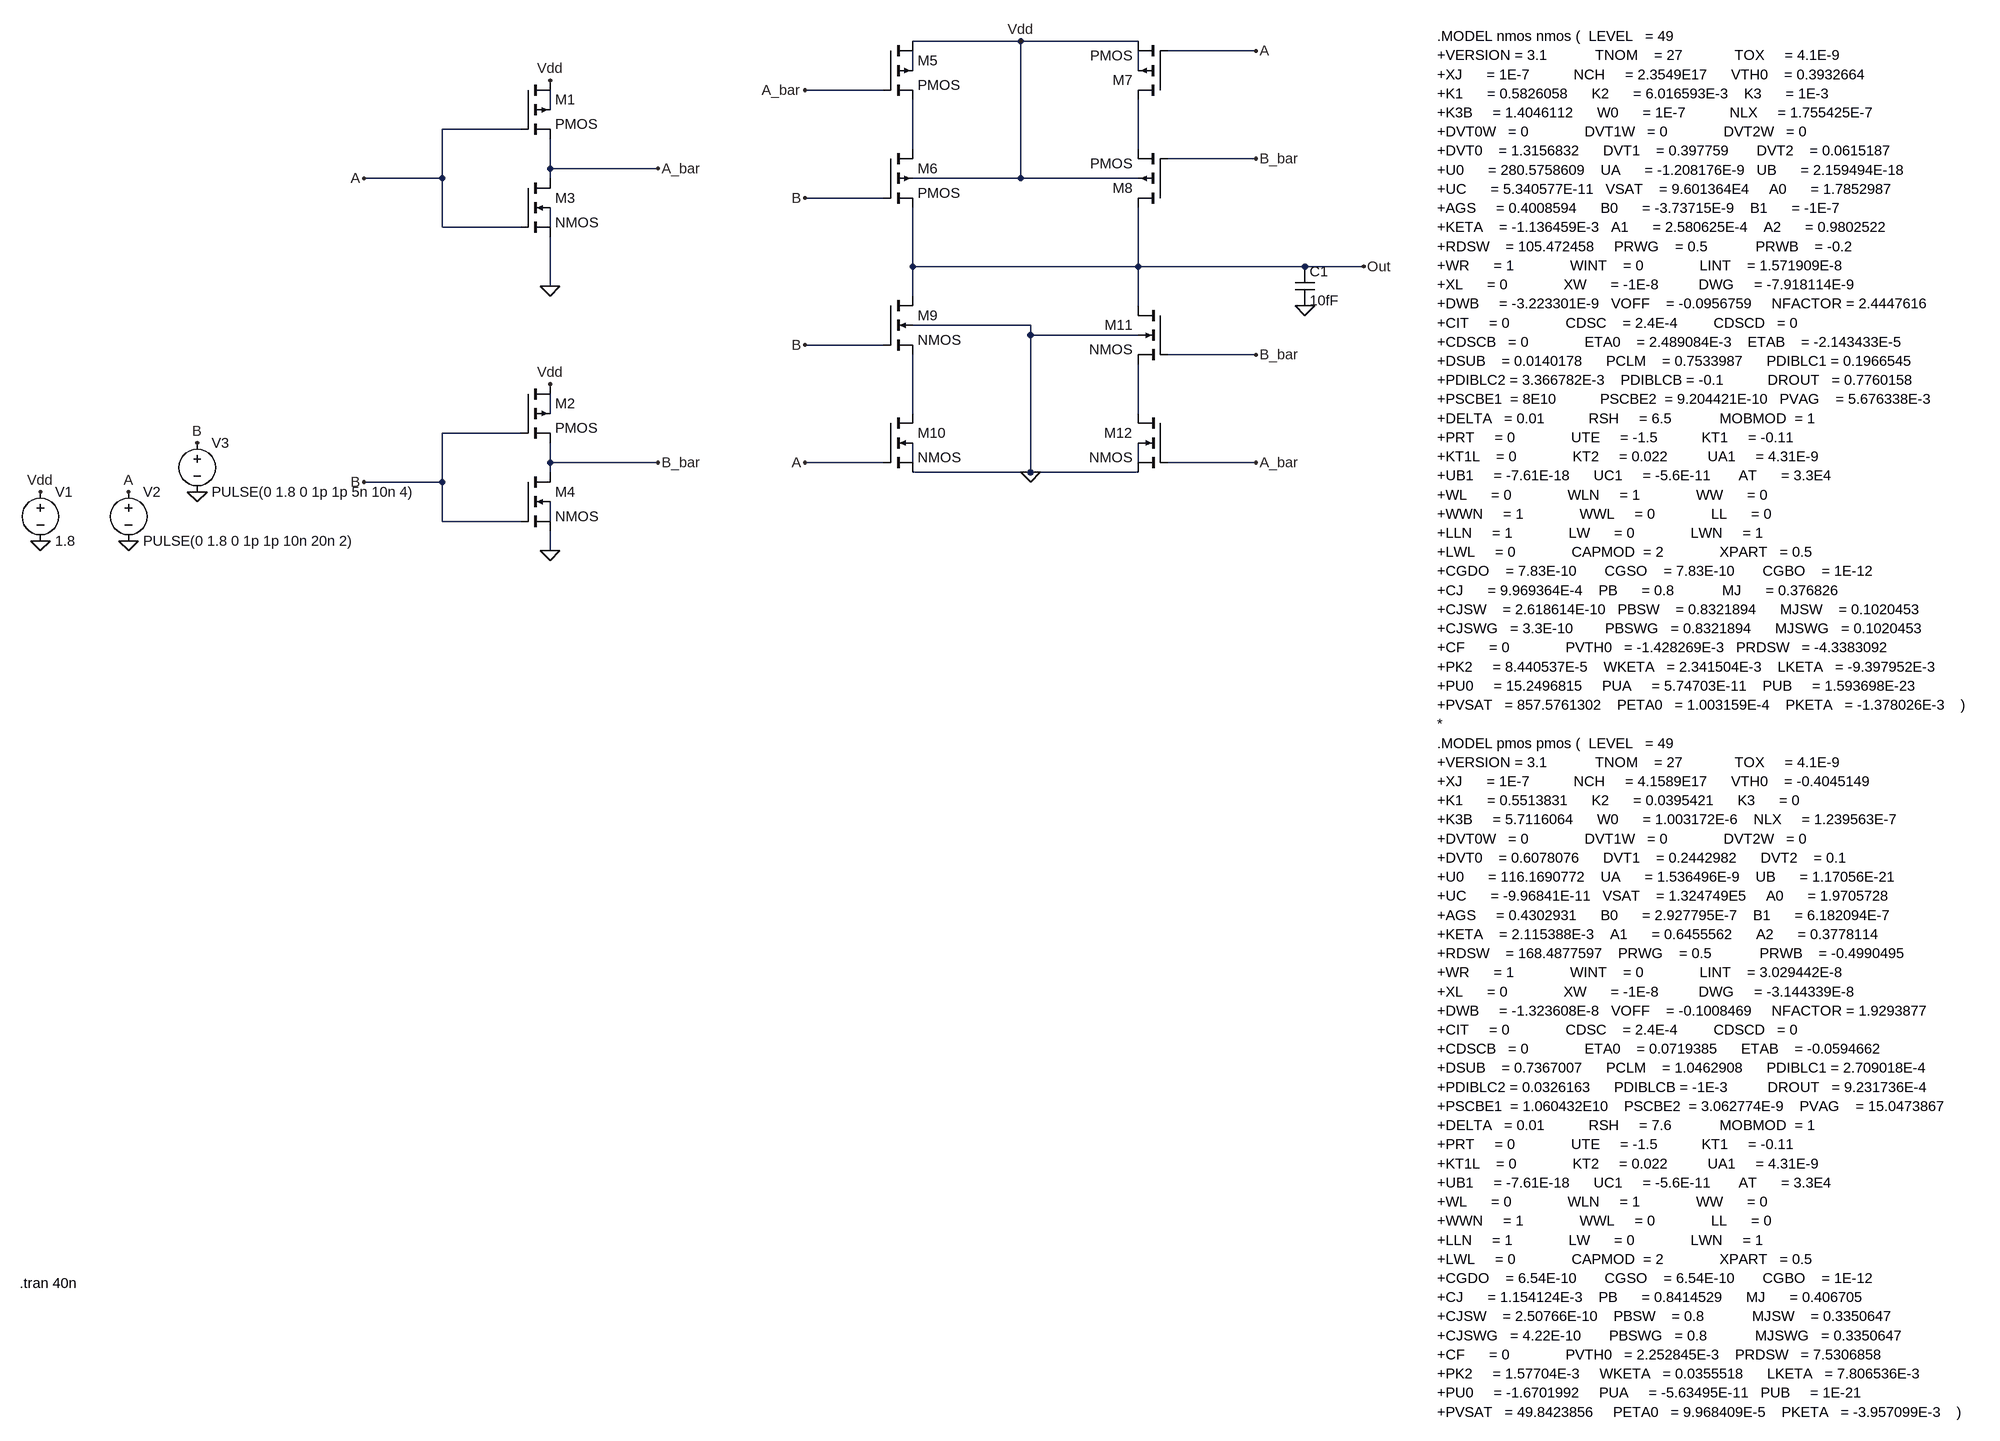
[diagram p0: schematic xor.asc]
xor.asc, the LTspice schematic file:
Version 4
SHEET 1 3156 1516
WIRE 1536 -528 1360 -528
WIRE 1728 -528 1536 -528
WIRE 1920 -512 1776 -512
WIRE 1360 -480 1360 -512
WIRE 1728 -480 1728 -512
WIRE 1312 -448 1184 -448
WIRE 768 -416 768 -448
WIRE 720 -384 592 -384
WIRE 1360 -352 1360 -432
WIRE 1728 -352 1728 -432
WIRE 1920 -336 1776 -336
WIRE 768 -320 768 -368
WIRE 944 -320 768 -320
WIRE 592 -304 592 -384
WIRE 592 -304 464 -304
WIRE 768 -304 768 -320
WIRE 1536 -304 1536 -528
WIRE 1536 -304 1360 -304
WIRE 1728 -304 1536 -304
WIRE 1312 -272 1184 -272
WIRE 592 -224 592 -304
WIRE 720 -224 592 -224
WIRE 768 -224 768 -256
WIRE 1360 -160 1360 -256
WIRE 1728 -160 1728 -256
WIRE 1728 -160 1360 -160
WIRE 2000 -160 1728 -160
WIRE 2096 -160 2000 -160
WIRE 768 -128 768 -208
WIRE 1360 -112 1360 -160
WIRE 1728 -96 1728 -160
WIRE 1552 -64 1360 -64
WIRE 1552 -48 1552 -64
WIRE 1728 -48 1552 -48
WIRE 1312 -32 1184 -32
WIRE 1920 -16 1776 -16
WIRE 768 80 768 48
WIRE 1360 80 1360 -16
WIRE 1728 80 1728 0
WIRE 720 112 592 112
WIRE 768 160 768 128
WIRE 944 160 768 160
WIRE 1312 160 1184 160
WIRE 1360 160 1360 128
WIRE 1728 160 1728 128
WIRE 1920 160 1776 160
WIRE 768 176 768 160
WIRE 1552 176 1552 -48
WIRE 1552 176 1360 176
WIRE 1728 176 1552 176
WIRE 592 192 592 112
WIRE 592 192 464 192
WIRE 592 256 592 192
WIRE 720 256 592 256
WIRE 768 256 768 224
WIRE 768 304 768 272
FLAG -64 288 0
FLAG 80 288 0
FLAG 192 208 0
FLAG 768 304 0
FLAG 768 -128 0
FLAG 2000 -96 0
FLAG 1552 176 0
FLAG 464 -304 A
FLAG 1184 160 A
FLAG 1920 -512 A
FLAG 2096 -160 Out
FLAG 464 192 B
FLAG 1184 -272 B
FLAG 1184 -32 B
FLAG 80 208 A
FLAG -64 208 Vdd
FLAG 1536 -528 Vdd
FLAG 944 -320 A_bar
FLAG 1184 -448 A_bar
FLAG 1920 160 A_bar
FLAG 944 160 B_bar
FLAG 1920 -336 B_bar
FLAG 1920 -16 B_bar
FLAG 768 32 Vdd
FLAG 768 -464 Vdd
FLAG 192 128 B
SYMBOL voltage -64 192 R0
SYMATTR InstName V1
SYMATTR Value 1.8
SYMBOL voltage 80 192 R0
WINDOW 123 0 0 Left 0
WINDOW 39 0 0 Left 0
SYMATTR InstName V2
SYMATTR Value PULSE(0 1.8 0 1p 1p 10n 20n 2)
SYMBOL voltage 192 112 R0
SYMATTR InstName V3
SYMATTR Value PULSE(0 1.8 0 1p 1p 5n 10n 4)
SYMBOL pmos4 720 -464 R0
SYMATTR InstName M1
SYMATTR Value2 l=180n w=360n
SYMBOL pmos4 720 32 R0
SYMATTR InstName M2
SYMATTR Value2 l=180n w=360n
SYMBOL nmos4 720 -304 R0
SYMATTR InstName M3
SYMATTR Value2 l=180n w=360n
SYMBOL nmos4 720 176 R0
SYMATTR InstName M4
SYMATTR Value2 l=180n w=360n
SYMBOL pmos4 1312 -528 R0
SYMATTR InstName M5
SYMATTR Value2 l=180n w=360n
SYMBOL pmos4 1312 -352 R0
SYMATTR InstName M6
SYMATTR Value2 l=180n w=360n
SYMBOL pmos4 1776 -432 R180
SYMATTR InstName M7
SYMATTR Value2 l=180n w=360n
SYMBOL pmos4 1776 -256 R180
SYMATTR InstName M8
SYMATTR Value2 l=180n w=360n
SYMBOL nmos4 1312 -112 R0
SYMATTR InstName M9
SYMATTR Value2 l=180n w=360n
SYMBOL nmos4 1312 80 R0
SYMATTR InstName M10
SYMATTR Value2 l=180n w=360n
SYMBOL nmos4 1776 -96 M0
SYMATTR InstName M11
SYMATTR Value2 l=180n w=360n
SYMBOL nmos4 1776 80 M0
SYMATTR InstName M12
SYMATTR Value2 l=180n w=360n
SYMBOL cap 1984 -160 R0
SYMATTR InstName C1
SYMATTR Value 10fF
TEXT 2216 -536 Left 2 !.MODEL nmos nmos (  LEVEL   = 49\n+VERSION = 3.1            TNOM    = 27             TOX     = 4.1E-9\n+XJ      = 1E-7           NCH     = 2.3549E17      VTH0    = 0.3932664\n+K1      = 0.5826058      K2      = 6.016593E-3    K3      = 1E-3\n+K3B     = 1.4046112      W0      = 1E-7           NLX     = 1.755425E-7\n+DVT0W   = 0              DVT1W   = 0              DVT2W   = 0\n+DVT0    = 1.3156832      DVT1    = 0.397759       DVT2    = 0.0615187\n+U0      = 280.5758609    UA      = -1.208176E-9   UB      = 2.159494E-18\n+UC      = 5.340577E-11   VSAT    = 9.601364E4     A0      = 1.7852987\n+AGS     = 0.4008594      B0      = -3.73715E-9    B1      = -1E-7\n+KETA    = -1.136459E-3   A1      = 2.580625E-4    A2      = 0.9802522\n+RDSW    = 105.472458     PRWG    = 0.5            PRWB    = -0.2\n+WR      = 1              WINT    = 0              LINT    = 1.571909E-8\n+XL      = 0              XW      = -1E-8          DWG     = -7.918114E-9\n+DWB     = -3.223301E-9   VOFF    = -0.0956759     NFACTOR = 2.4447616\n+CIT     = 0              CDSC    = 2.4E-4         CDSCD   = 0\n+CDSCB   = 0              ETA0    = 2.489084E-3    ETAB    = -2.143433E-5\n+DSUB    = 0.0140178      PCLM    = 0.7533987      PDIBLC1 = 0.1966545\n+PDIBLC2 = 3.366782E-3    PDIBLCB = -0.1           DROUT   = 0.7760158\n+PSCBE1  = 8E10           PSCBE2  = 9.204421E-10   PVAG    = 5.676338E-3\n+DELTA   = 0.01           RSH     = 6.5            MOBMOD  = 1\n+PRT     = 0              UTE     = -1.5           KT1     = -0.11\n+KT1L    = 0              KT2     = 0.022          UA1     = 4.31E-9\n+UB1     = -7.61E-18      UC1     = -5.6E-11       AT      = 3.3E4\n+WL      = 0              WLN     = 1              WW      = 0\n+WWN     = 1              WWL     = 0              LL      = 0\n+LLN     = 1              LW      = 0              LWN     = 1\n+LWL     = 0              CAPMOD  = 2              XPART   = 0.5\n+CGDO    = 7.83E-10       CGSO    = 7.83E-10       CGBO    = 1E-12\n+CJ      = 9.969364E-4    PB      = 0.8            MJ      = 0.376826\n+CJSW    = 2.618614E-10   PBSW    = 0.8321894      MJSW    = 0.1020453\n+CJSWG   = 3.3E-10        PBSWG   = 0.8321894      MJSWG   = 0.1020453\n+CF      = 0              PVTH0   = -1.428269E-3   PRDSW   = -4.3383092\n+PK2     = 8.440537E-5    WKETA   = 2.341504E-3    LKETA   = -9.397952E-3\n+PU0     = 15.2496815     PUA     = 5.74703E-11    PUB     = 1.593698E-23\n+PVSAT   = 857.5761302    PETA0   = 1.003159E-4    PKETA   = -1.378026E-3    )\n*\n.MODEL pmos pmos (  LEVEL   = 49\n+VERSION = 3.1            TNOM    = 27             TOX     = 4.1E-9\n+XJ      = 1E-7           NCH     = 4.1589E17      VTH0    = -0.4045149\n+K1      = 0.5513831      K2      = 0.0395421      K3      = 0\n+K3B     = 5.7116064      W0      = 1.003172E-6    NLX     = 1.239563E-7\n+DVT0W   = 0              DVT1W   = 0              DVT2W   = 0\n+DVT0    = 0.6078076      DVT1    = 0.2442982      DVT2    = 0.1\n+U0      = 116.1690772    UA      = 1.536496E-9    UB      = 1.17056E-21\n+UC      = -9.96841E-11   VSAT    = 1.324749E5     A0      = 1.9705728\n+AGS     = 0.4302931      B0      = 2.927795E-7    B1      = 6.182094E-7\n+KETA    = 2.115388E-3    A1      = 0.6455562      A2      = 0.3778114\n+RDSW    = 168.4877597    PRWG    = 0.5            PRWB    = -0.4990495\n+WR      = 1              WINT    = 0              LINT    = 3.029442E-8\n+XL      = 0              XW      = -1E-8          DWG     = -3.144339E-8\n+DWB     = -1.323608E-8   VOFF    = -0.1008469     NFACTOR = 1.9293877\n+CIT     = 0              CDSC    = 2.4E-4         CDSCD   = 0\n+CDSCB   = 0              ETA0    = 0.0719385      ETAB    = -0.0594662\n+DSUB    = 0.7367007      PCLM    = 1.0462908      PDIBLC1 = 2.709018E-4\n+PDIBLC2 = 0.0326163      PDIBLCB = -1E-3          DROUT   = 9.231736E-4\n+PSCBE1  = 1.060432E10    PSCBE2  = 3.062774E-9    PVAG    = 15.0473867\n+DELTA   = 0.01           RSH     = 7.6            MOBMOD  = 1\n+PRT     = 0              UTE     = -1.5           KT1     = -0.11\n+KT1L    = 0              KT2     = 0.022          UA1     = 4.31E-9\n+UB1     = -7.61E-18      UC1     = -5.6E-11       AT      = 3.3E4\n+WL      = 0              WLN     = 1              WW      = 0\n+WWN     = 1              WWL     = 0              LL      = 0\n+LLN     = 1              LW      = 0              LWN     = 1\n+LWL     = 0              CAPMOD  = 2              XPART   = 0.5\n+CGDO    = 6.54E-10       CGSO    = 6.54E-10       CGBO    = 1E-12\n+CJ      = 1.154124E-3    PB      = 0.8414529      MJ      = 0.406705\n+CJSW    = 2.50766E-10    PBSW    = 0.8            MJSW    = 0.3350647\n+CJSWG   = 4.22E-10       PBSWG   = 0.8            MJSWG   = 0.3350647\n+CF      = 0              PVTH0   = 2.252845E-3    PRDSW   = 7.5306858\n+PK2     = 1.57704E-3     WKETA   = 0.0355518      LKETA   = 7.806536E-3\n+PU0     = -1.6701992     PUA     = -5.63495E-11   PUB     = 1E-21\n+PVSAT   = 49.8423856     PETA0   = 9.968409E-5    PKETA   = -3.957099E-3    )
TEXT -98 1500 Left 2 !.tran 40n

The netlist it stands for:
* xor.asc
V1 Vdd 0 1.8
V2 A 0 PULSE(0 1.8 0 1p 1p 10n 20n 2)
V3 B 0 PULSE(0 1.8 0 1p 1p 5n 10n 4)
M1 Vdd A A_bar N003 PMOS l=180n w=360n
M2 Vdd B B_bar N007 PMOS l=180n w=360n
M3 A_bar A 0 N006 NMOS l=180n w=360n
M4 B_bar B 0 N012 NMOS l=180n w=360n
M5 Vdd A_bar N004 N001 PMOS l=180n w=360n
M6 N004 B Out Vdd PMOS l=180n w=360n
M7 N005 A Vdd N002 PMOS l=180n w=360n
M8 Out B_bar N005 Vdd PMOS l=180n w=360n
M9 Out B N008 0 NMOS l=180n w=360n
M10 N008 A 0 N010 NMOS l=180n w=360n
M11 Out B_bar N009 0 NMOS l=180n w=360n
M12 N009 A_bar 0 N011 NMOS l=180n w=360n
C1 Out 0 10fF
.model NMOS NMOS
.model PMOS PMOS
.lib standard.mos
.MODEL nmos nmos (  LEVEL   = 49
+VERSION = 3.1            TNOM    = 27             TOX     = 4.1E-9
+XJ      = 1E-7           NCH     = 2.3549E17      VTH0    = 0.3932664
+K1      = 0.5826058      K2      = 6.016593E-3    K3      = 1E-3
+K3B     = 1.4046112      W0      = 1E-7           NLX     = 1.755425E-7
+DVT0W   = 0              DVT1W   = 0              DVT2W   = 0
+DVT0    = 1.3156832      DVT1    = 0.397759       DVT2    = 0.0615187
+U0      = 280.5758609    UA      = -1.208176E-9   UB      = 2.159494E-18
+UC      = 5.340577E-11   VSAT    = 9.601364E4     A0      = 1.7852987
+AGS     = 0.4008594      B0      = -3.73715E-9    B1      = -1E-7
+KETA    = -1.136459E-3   A1      = 2.580625E-4    A2      = 0.9802522
+RDSW    = 105.472458     PRWG    = 0.5            PRWB    = -0.2
+WR      = 1              WINT    = 0              LINT    = 1.571909E-8
+XL      = 0              XW      = -1E-8          DWG     = -7.918114E-9
+DWB     = -3.223301E-9   VOFF    = -0.0956759     NFACTOR = 2.4447616
+CIT     = 0              CDSC    = 2.4E-4         CDSCD   = 0
+CDSCB   = 0              ETA0    = 2.489084E-3    ETAB    = -2.143433E-5
+DSUB    = 0.0140178      PCLM    = 0.7533987      PDIBLC1 = 0.1966545
+PDIBLC2 = 3.366782E-3    PDIBLCB = -0.1           DROUT   = 0.7760158
+PSCBE1  = 8E10           PSCBE2  = 9.204421E-10   PVAG    = 5.676338E-3
+DELTA   = 0.01           RSH     = 6.5            MOBMOD  = 1
+PRT     = 0              UTE     = -1.5           KT1     = -0.11
+KT1L    = 0              KT2     = 0.022          UA1     = 4.31E-9
+UB1     = -7.61E-18      UC1     = -5.6E-11       AT      = 3.3E4
+WL      = 0              WLN     = 1              WW      = 0
+WWN     = 1              WWL     = 0              LL      = 0
+LLN     = 1              LW      = 0              LWN     = 1
+LWL     = 0              CAPMOD  = 2              XPART   = 0.5
+CGDO    = 7.83E-10       CGSO    = 7.83E-10       CGBO    = 1E-12
+CJ      = 9.969364E-4    PB      = 0.8            MJ      = 0.376826
+CJSW    = 2.618614E-10   PBSW    = 0.8321894      MJSW    = 0.1020453
+CJSWG   = 3.3E-10        PBSWG   = 0.8321894      MJSWG   = 0.1020453
+CF      = 0              PVTH0   = -1.428269E-3   PRDSW   = -4.3383092
+PK2     = 8.440537E-5    WKETA   = 2.341504E-3    LKETA   = -9.397952E-3
+PU0     = 15.2496815     PUA     = 5.74703E-11    PUB     = 1.593698E-23
+PVSAT   = 857.5761302    PETA0   = 1.003159E-4    PKETA   = -1.378026E-3    )
*
.MODEL pmos pmos (  LEVEL   = 49
+VERSION = 3.1            TNOM    = 27             TOX     = 4.1E-9
+XJ      = 1E-7           NCH     = 4.1589E17      VTH0    = -0.4045149
+K1      = 0.5513831      K2      = 0.0395421      K3      = 0
+K3B     = 5.7116064      W0      = 1.003172E-6    NLX     = 1.239563E-7
+DVT0W   = 0              DVT1W   = 0              DVT2W   = 0
+DVT0    = 0.6078076      DVT1    = 0.2442982      DVT2    = 0.1
+U0      = 116.1690772    UA      = 1.536496E-9    UB      = 1.17056E-21
+UC      = -9.96841E-11   VSAT    = 1.324749E5     A0      = 1.9705728
+AGS     = 0.4302931      B0      = 2.927795E-7    B1      = 6.182094E-7
+KETA    = 2.115388E-3    A1      = 0.6455562      A2      = 0.3778114
+RDSW    = 168.4877597    PRWG    = 0.5            PRWB    = -0.4990495
+WR      = 1              WINT    = 0              LINT    = 3.029442E-8
+XL      = 0              XW      = -1E-8          DWG     = -3.144339E-8
+DWB     = -1.323608E-8   VOFF    = -0.1008469     NFACTOR = 1.9293877
+CIT     = 0              CDSC    = 2.4E-4         CDSCD   = 0
+CDSCB   = 0              ETA0    = 0.0719385      ETAB    = -0.0594662
+DSUB    = 0.7367007      PCLM    = 1.0462908      PDIBLC1 = 2.709018E-4
+PDIBLC2 = 0.0326163      PDIBLCB = -1E-3          DROUT   = 9.231736E-4
+PSCBE1  = 1.060432E10    PSCBE2  = 3.062774E-9    PVAG    = 15.0473867
+DELTA   = 0.01           RSH     = 7.6            MOBMOD  = 1
+PRT     = 0              UTE     = -1.5           KT1     = -0.11
+KT1L    = 0              KT2     = 0.022          UA1     = 4.31E-9
+UB1     = -7.61E-18      UC1     = -5.6E-11       AT      = 3.3E4
+WL      = 0              WLN     = 1              WW      = 0
+WWN     = 1              WWL     = 0              LL      = 0
+LLN     = 1              LW      = 0              LWN     = 1
+LWL     = 0              CAPMOD  = 2              XPART   = 0.5
+CGDO    = 6.54E-10       CGSO    = 6.54E-10       CGBO    = 1E-12
+CJ      = 1.154124E-3    PB      = 0.8414529      MJ      = 0.406705
+CJSW    = 2.50766E-10    PBSW    = 0.8            MJSW    = 0.3350647
+CJSWG   = 4.22E-10       PBSWG   = 0.8            MJSWG   = 0.3350647
+CF      = 0              PVTH0   = 2.252845E-3    PRDSW   = 7.5306858
+PK2     = 1.57704E-3     WKETA   = 0.0355518      LKETA   = 7.806536E-3
+PU0     = -1.6701992     PUA     = -5.63495E-11   PUB     = 1E-21
+PVSAT   = 49.8423856     PETA0   = 9.968409E-5    PKETA   = -3.957099E-3    )
.tran 40n
.backanno
.end